# Altium schematic sheet I2C_Shiled.SchDoc: BRAWL STARS
size A3; Address1: Dynamike TR3; Revision: VER 1.0; SheetNumber: 1; SheetTotal: 1
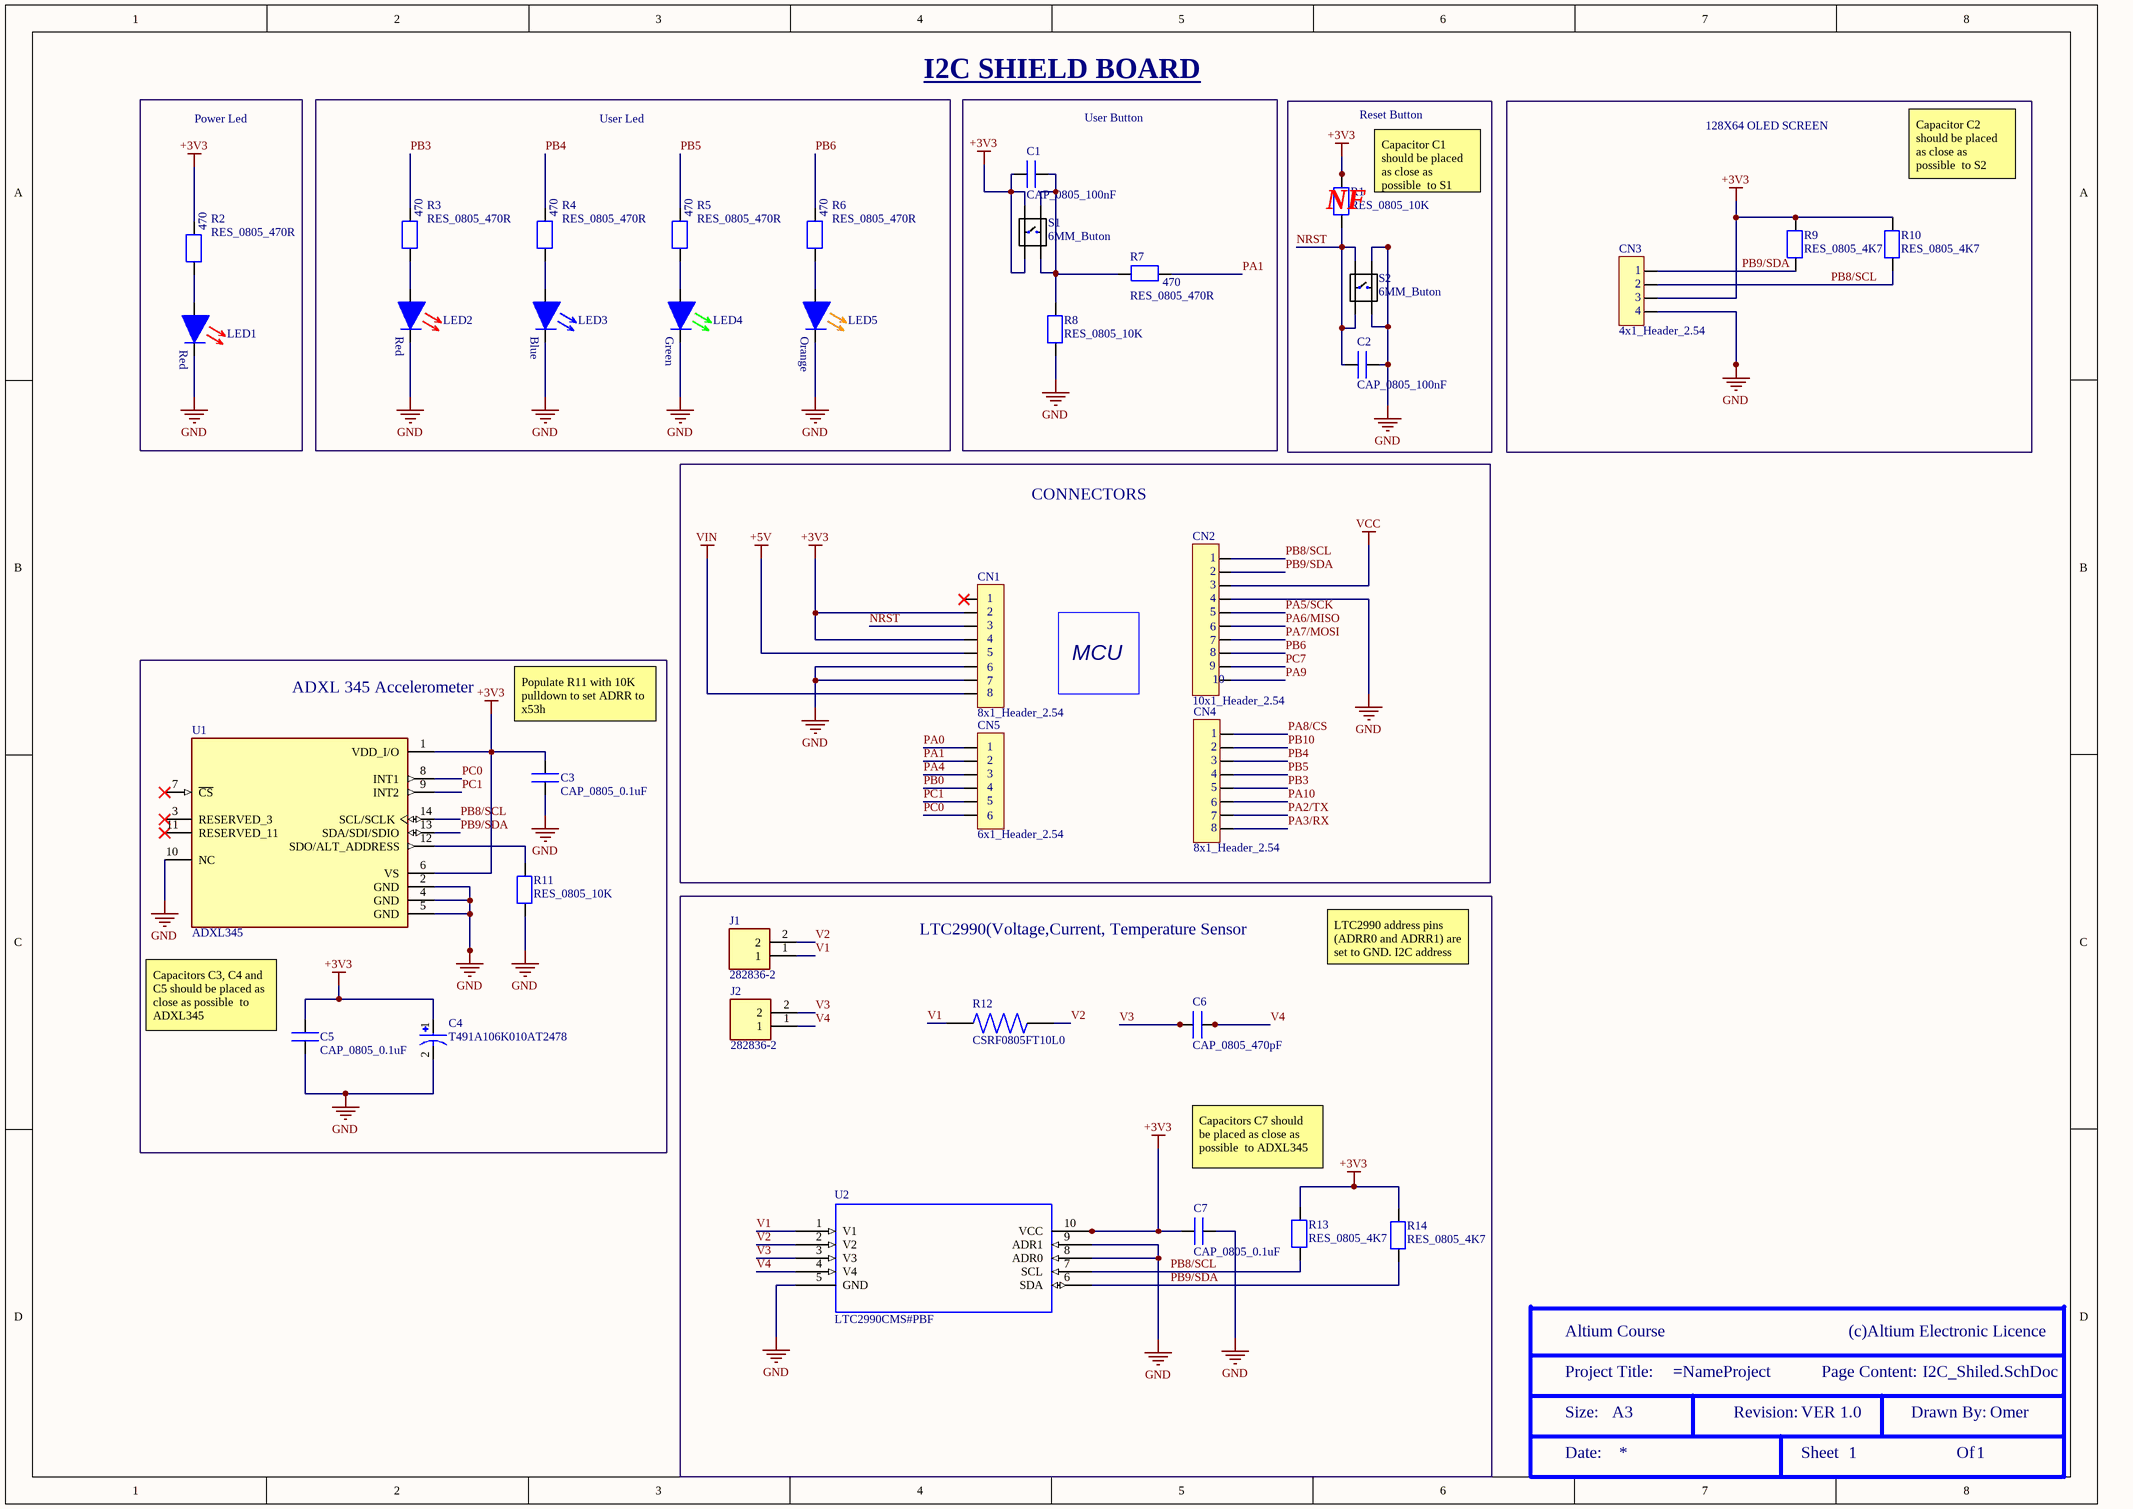
[diagram p0: I2C_Shiled.SchDoc]

## Parts
*  Size: A3  Drawn By: Omer  (hidden comment: Title Block)  (graphical)
C1  CAP_0805_100nF  [CAP_0805]
C2  CAP_0805_100nF  [CAP_0805]
C3  CAP_0805_0.1uF  [CAP_0805]
C4  T491A106K010AT2478  [CAPMP3216X180N]
C5  CAP_0805_0.1uF  [CAP_0805]
C6  CAP_0805_470pF  [CAP_0805]
C7  CAP_0805_0.1uF  [CAP_0805]
CN1  8x1_Header_2.54  [8x1_2.54MM_HEADER]
CN2  10x1_Header_2.54  [10x1_2.54MM_HEADER]
CN3  4x1_Header_2.54  [4x1_2.54MM_HEADER]
CN4  8x1_Header_2.54  [8x1_2.54MM_HEADER]
CN5  6x1_Header_2.54  [6x1_2.54MM_HEADER]
J1  282836-2  [TE_282836-2]
J2  282836-2  [TE_282836-2]
LED1  DIODE_0805_Red  [LED_0805]  (value not drawn)
LED2  DIODE_0805_Red  [LED_0805]  (value not drawn)
LED3  DIODE_0805_Blue  [LED_0805]  (value not drawn)
LED4  DIODE_0805_Green  [LED_0805]  (value not drawn)
LED5  DIODE_0805_Orange  [LED_0805]  (value not drawn)
R1  RES_0805_10K  [RES_0805]
R2  RES_0805_470R  [RES_0805]
R3  RES_0805_470R  [RES_0805]
R4  RES_0805_470R  [RES_0805]
R5  RES_0805_470R  [RES_0805]
R6  RES_0805_470R  [RES_0805]
R7  RES_0805_470R  [RES_0805]
R8  RES_0805_10K  [RES_0805]
R9  RES_0805_4K7  [RES_0805]
R10  RES_0805_4K7  [RES_0805]
R11  RES_0805_10K  [RES_0805]
R12  CSRF0805FT10L0  [RESC2113X85N]
R13  RES_0805_4K7  [RES_0805]
R14  RES_0805_4K7  [RES_0805]
S1  6MM_Buton  [6MM_TACTILE_SWITCH]
S2  6MM_Buton  [6MM_TACTILE_SWITCH]
U1  ADXL345  [PQFN80P500X300X100-14N]
U2  LTC2990CMS#PBF  [MSOP-10_MS]

## Blocks framed on the sheet
Power Led: LED1 R2
I2C SHIELD BOARD: LED2-LED5 R3-R6
User Button: C1 R7 R8 S1
NF: C2 R1 S2
128X64 OLED SCREEN: CN3 R9 R10
MCU: CN1 CN2 CN4 CN5
ADXL 345 Accelerometer: C3-C5 R11 U1
LTC2990(Voltage,Current, Temperature Sensor: C6 C7 J1 J2 R12-R14 U2

## Nets
+3V3: C1.1 C3.2 C4.1 C5.2 C7.1 CN1.02 CN1.04 CN3.03 R1.2 R2.2 R9.2 R10.2 R13.2 R14.2 S1.1 S1.3 U1.1(VDD_I/O) U1.6(VS) U2.10(VCC)
+5V: CN1.05
GND: C2.2 C3.1 C4.2 C5.1 C7.2 CN1.06 CN1.07 CN2.04 CN3.04 LED1.C LED2.C LED3.C LED4.C LED5.C R8.1 R11.1 S2.2 S2.4 U1.2(GND) U1.4(GND) U1.5(GND) U1.10(NC) U2.5(GND) U2.8(ADR0) U2.9(ADR1)
VCC: CN2.03
VIN: CN1.08
NRST: C2.1 CN1.03 R1.1 S2.1 S2.3
PA0: CN5.01
PA1: CN5.02 R7.2
PA2/TX: CN4.07
PA3/RX: CN4.08
PA4: CN5.03
PA5/SCK: CN2.05
PA6/MISO: CN2.06
PA7/MOSI: CN2.07
PA8/CS: CN4.01
PA9: CN2.10
PA10: CN4.06
PB0: CN5.04
PB3: CN4.05 R3.2
PB4: CN4.03 R4.2
PB5: CN4.04 R5.2
PB6: CN2.08 R6.2
PB8/SCL: CN2.01 CN3.02 R10.1 R13.1 U1.14(SCL/SCLK) U2.7(SCL)
PB9/SDA: CN2.02 CN3.01 R9.1 R14.1 U1.13(SDA/SDI/SDIO) U2.6(SDA)
PB10: CN4.02
PC0: CN5.06 U1.8(INT1)
PC1: CN5.05 U1.9(INT2)
PC7: CN2.09
V1: J1.1 R12.1 U2.1(V1)
V2: J1.2 R12.2 U2.2(V2)
V3: C6.1 J2.2 U2.3(V3)
V4: C6.2 J2.1 U2.4(V4)
NetC1_2: C1.2 R7.1 R8.2 S1.2 S1.4
NetLED1_A: LED1.A R2.1
NetLED2_A: LED2.A R3.1
NetLED3_A: LED3.A R4.1
NetLED4_A: LED4.A R5.1
NetLED5_A: LED5.A R6.1
NetR11_2: R11.2 U1.12(SDO/ALT_ADDRESS)

Not connected (* = marked no-connect by the designer): CN1 01*; U1 3(RESERVED_3)* 7(~{CS})* 11(RESERVED_11)*

## Notes on the sheet
- User Led
- Reset Button
- Capacitor C2 should be placed as close as possible  to S2
- (near R1) Capacitor C1 should be placed as close as possible  to S1
- CONNECTORS
- (near C3) Populate R11 with 10K pulldown to set ADRR to x53h
- LTC2990 address pins (ADRR0 and ADRR1) are set to GND. I2C address is 0x98h.
- Capacitors C3, C4 and C5 should be placed as close as possible  to ADXL345
- Capacitors C7 should be placed as close as possible  to ADXL345
- Title
- Size:
- Date:
- A3
- Number:
- Time:
- Revision:
- Sheet
- of
- File:
- (in symbol 4x1_Header_2.54) 1; 2; 3; 4
- (in symbol 6x1_Header_2.54) 1; 2; 3; 4; 5; 6
- (in symbol 8x1_Header_2.54) 1; 2; 3; 4; 5; 6; 7; 8
- (in symbol 10x1_Header_2.54) 1; 2; 3; 4; 5; 6; 7; 8; 9
- (in symbol LED_0805_Blue) Blue
- (in symbol LED_0805_Green) Green
- (in symbol LED_0805_Orange) Orange
- (in symbol LED_0805_Red) Red
- (in symbol RES_0805_470R) 470
- (in symbol Title Block) Altium Course; (c)Altium Electronic Licence; Project Title:; Page Content:; Size:; Revision:; Drawn By:; Date:; Sheet; Of

## Library data of the parts
C1 C2 = CAP_0805_100nF: 0805 100nF 16VDC 10% X7R; Tolerance: %10; Voltage Rating: 16 V; Dielectric: X7R; Manufacturer: https://www.ozdisan.com/p/smt-smd-ve-mlcc-kapasitorler-184/yageo-ac0805krx7r7bb104-750224?catSequenceId=184; Package Size: 0805
C3 C5 C7 = CAP_0805_0.1uF: 0805 0.1uF 16VDC 10% X7R; Tolerance: %10; Voltage Rating: 16 V; Dielectric: X7R; Manufacturer: https://www.ozdisan.com/p/smt-smd-ve-mlcc-kapasitorler-184/yageo-ac0805krx7r7bb104-750224?catSequenceId=184; Package Size: 0805
C4 = T491A106K010AT2478: 10 ÂµF Molded Tantalum Capacitors 10 V 1206 (3216 Metric) 3.8Ohm; MF: KEMET; Price: None; Value: *; MP: T491A106K010AT2478; Package: SMD-2 KEMET; Purchase-URL: https://pricing.snapeda.com/search/part/T491A106K010AT2478/?ref=eda; SnapEDA_Link: https://www.snapeda.com/parts/T491A106K010AT2478/KEMET/view-part/?ref=snap; Check_prices: https://www.snapeda.com/parts/T491A106K010AT2478/KEMET/view-part/?ref=eda; Availability: In Stock
C6 = CAP_0805_470pF: 0805 470pF 16VDC 10% X7R; Tolerance: %10; Voltage Rating: 16 V; Dielectric: X7R; Manufacturer: https://www.ozdisan.com/p/smt-smd-ve-mlcc-kapasitorler-184/yageo-ac0805krx7r7bb104-750224?catSequenceId=184; Package Size: 0805
CN1 CN4 = 8x1_Header_2.54: Arduino Boards Connector; Manufacturer: https://www.e-komponent.com/arduino-boards-or-other-mcu-boards-connector?srsltid=AfmBOorUMZQOrsv8Wt15kW0DGxl8hyw4h0X0K5JN5829Gr0faX_RqlTh; Package Size: 8x1
CN2 = 10x1_Header_2.54: Arduino Boards Connector; Manufacturer: https://www.e-komponent.com/arduino-boards-or-other-mcu-boards-connector?srsltid=AfmBOorUMZQOrsv8Wt15kW0DGxl8hyw4h0X0K5JN5829Gr0faX_RqlTh; Package Size: 10x1
CN3 = 4x1_Header_2.54: OLED SCREEN HEADER; Manufacturer: https://www.ozdisan.com/p/disi-headerlar-294/connfly-ds1023-1x4sf11-454409?srsltid=AfmBOoq8A8ibqNV5gJOb4Q5V-kVBNNSoQ6d5VbQvHKFdoBYv37HZCifS; Package Size: 4x1
CN5 = 6x1_Header_2.54: Arduino Boards Connector; Manufacturer: https://www.e-komponent.com/arduino-boards-or-other-mcu-boards-connector?srsltid=AfmBOorUMZQOrsv8Wt15kW0DGxl8hyw4h0X0K5JN5829Gr0faX_RqlTh; Package Size: 6x1
J1 J2 = 282836-2: Connector, Terminal Block; Wire Receptacle; 2 Pos.; 16-30 AWG; 0.197 in. CL; Sid; MF: TE Connectivity; Purchase-URL: https://pricing.snapeda.com/search/part/282836-2/?ref=eda; Value: *; MP: 282836-2; Package: None; Check_prices: https://www.snapeda.com/parts/282836-2/TE+Connectivity+AMP+Connectors/view-part/?ref=eda; Price: None; SnapEDA_Link: https://www.snapeda.com/parts/282836-2/TE+Connectivity+AMP+Connectors/view-part/?ref=snap; Availability: In Stock
LED1 LED2 = LED_0805_Red: LED SMD 0805 RED 160-210mcd; Voltage Rating: 2.6V; Current: 20mA; Manufacturer: https://www.ozdisan.com/p/sinyal-ledler-tek-renkli-361/honglitronic-hl-psc-2012u51gc-471651; Package Size: 0805
LED3 = LED_0805_Blue: LED SMD 0805 BLUE 160-210mcd; Voltage Rating: 2.6V; Current: 20mA; Manufacturer: https://www.ozdisan.com/p/sinyal-ledler-tek-renkli-361/honglitronic-hl-psc-2012u51gc-471651; Package Size: 0805
LED4 = LED_0805_Green: LED SMD 0805 GREEN160-210mcd; Voltage Rating: 2.6V; Current: 20mA; Manufacturer: https://www.ozdisan.com/p/sinyal-ledler-tek-renkli-361/honglitronic-hl-psc-2012u51gc-471651; Package Size: 0805
LED5 = LED_0805_Orange: LED SMD 0805 ORANGE 160-210mcd; Voltage Rating: 2.6V; Current: 20mA; Manufacturer: https://www.ozdisan.com/p/sinyal-ledler-tek-renkli-361/honglitronic-hl-psc-2012u51gc-471651; Package Size: 0805
R1 R8 R11 = RES_0805_10K: 0805 10K Ohms 5%; Voltage Rating: 150V; Tolerance: %5; Manufacturer: https://www.ozdisan.com/p/smt-smd-ve-cip-direncler-194/yageo-rc0805jr-0710kl-515420?catSequenceId=194; Package Size: 0805
R2-R7 = RES_0805_470R: 0805 470 Ohms 5%; Tolerance: %5; Voltage Rating: 150V; Manufacturer: https://www.ozdisan.com/p/smt-smd-ve-cip-direncler-194/yageo-rc0805jr-07470rl-504397?catSequenceId=194; Package Size: 0805
R9 R10 R13 R14 = RES_0805_4K7: 0805 4K7 Ohms 5%; Voltage Rating: 150V; Tolerance: %5; Manufacturer: https://www.ozdisan.com/p/smt-smd-ve-cip-direncler-194/yageo-rc0805jr-0710kl-515420?catSequenceId=194; Package Size: 0805
R12 = CSRF0805FT10L0: 10 mOhms Â±1% 0.5W, 1/2W Chip Resistor 0805 (2012 Metric) Automotive AEC-Q200, Current Sense, Moisture Resistant Metal Foil; MF: Stackpole Electronics; SnapEDA_Link: https://www.snapeda.com/parts/CSRF0805FT10L0/Stackpole+Electronics/view-part/?ref=snap; Package: 0805 Stackpole Electronics; Value: *; MP: CSRF0805FT10L0; Check_prices: https://www.snapeda.com/parts/CSRF0805FT10L0/Stackpole+Electronics/view-part/?ref=eda
S1 S2 = 6MM_Buton: SWITCH TACT 12.00x12.00 6.00mm; Current: 50mA; Voltage Rating: 12V; Manufacturer: https://www.ozdisan.com/p/tact-sivicler-485/connfly-ds1042-2-17-kkrx-160-10-501388?catSequenceId=485; Package Size: 6mm x 6mm
U1 = ADXL345: Accelerometer X, Y, Z Axis ±2g, 4g, 8g, 16g 0.05Hz ~ 1.6kHz 14-LGA (3x5); MF: Analog Devices, Inc.; SnapEDA_Link: https://www.snapeda.com/parts/ADXL345/Analog+Devices/view-part/?ref=snap; Package: LGA -14 Analog Devices; Value: *; MP: ADXL345; Check_prices: https://www.snapeda.com/parts/ADXL345/Analog+Devices/view-part/?ref=eda
U2 = LTC2990CMS#PBF: IC, SUPERVISORY, 1.1mA, 5.5V, MSOP10; No; IC, SUPERVISORY, 1.1mA, 5.5V, MSOP10; No. of Supervisors / Monitors:4; Supply Voltage Range:2.9V to 5.5V; Digital IC Case Style:MSOP; No. of Pins:10; Supply Current:1.1mA; Delay Time:46ms; Operating Temperature Ra; MF: Analog Devices; SnapEDA_Link: https://www.snapeda.com/parts/LTC2990CMS%23PBF/Analog+Devices/view-part/?ref=snap; Package: MSOP-10 Linear Technology; Value: *; MP: LTC2990CMS#PBF; Check_prices: https://www.snapeda.com/parts/LTC2990CMS%23PBF/Analog+Devices/view-part/?ref=eda